# EAGLE schematic 6xshift_reg (EAGLE 5.11)
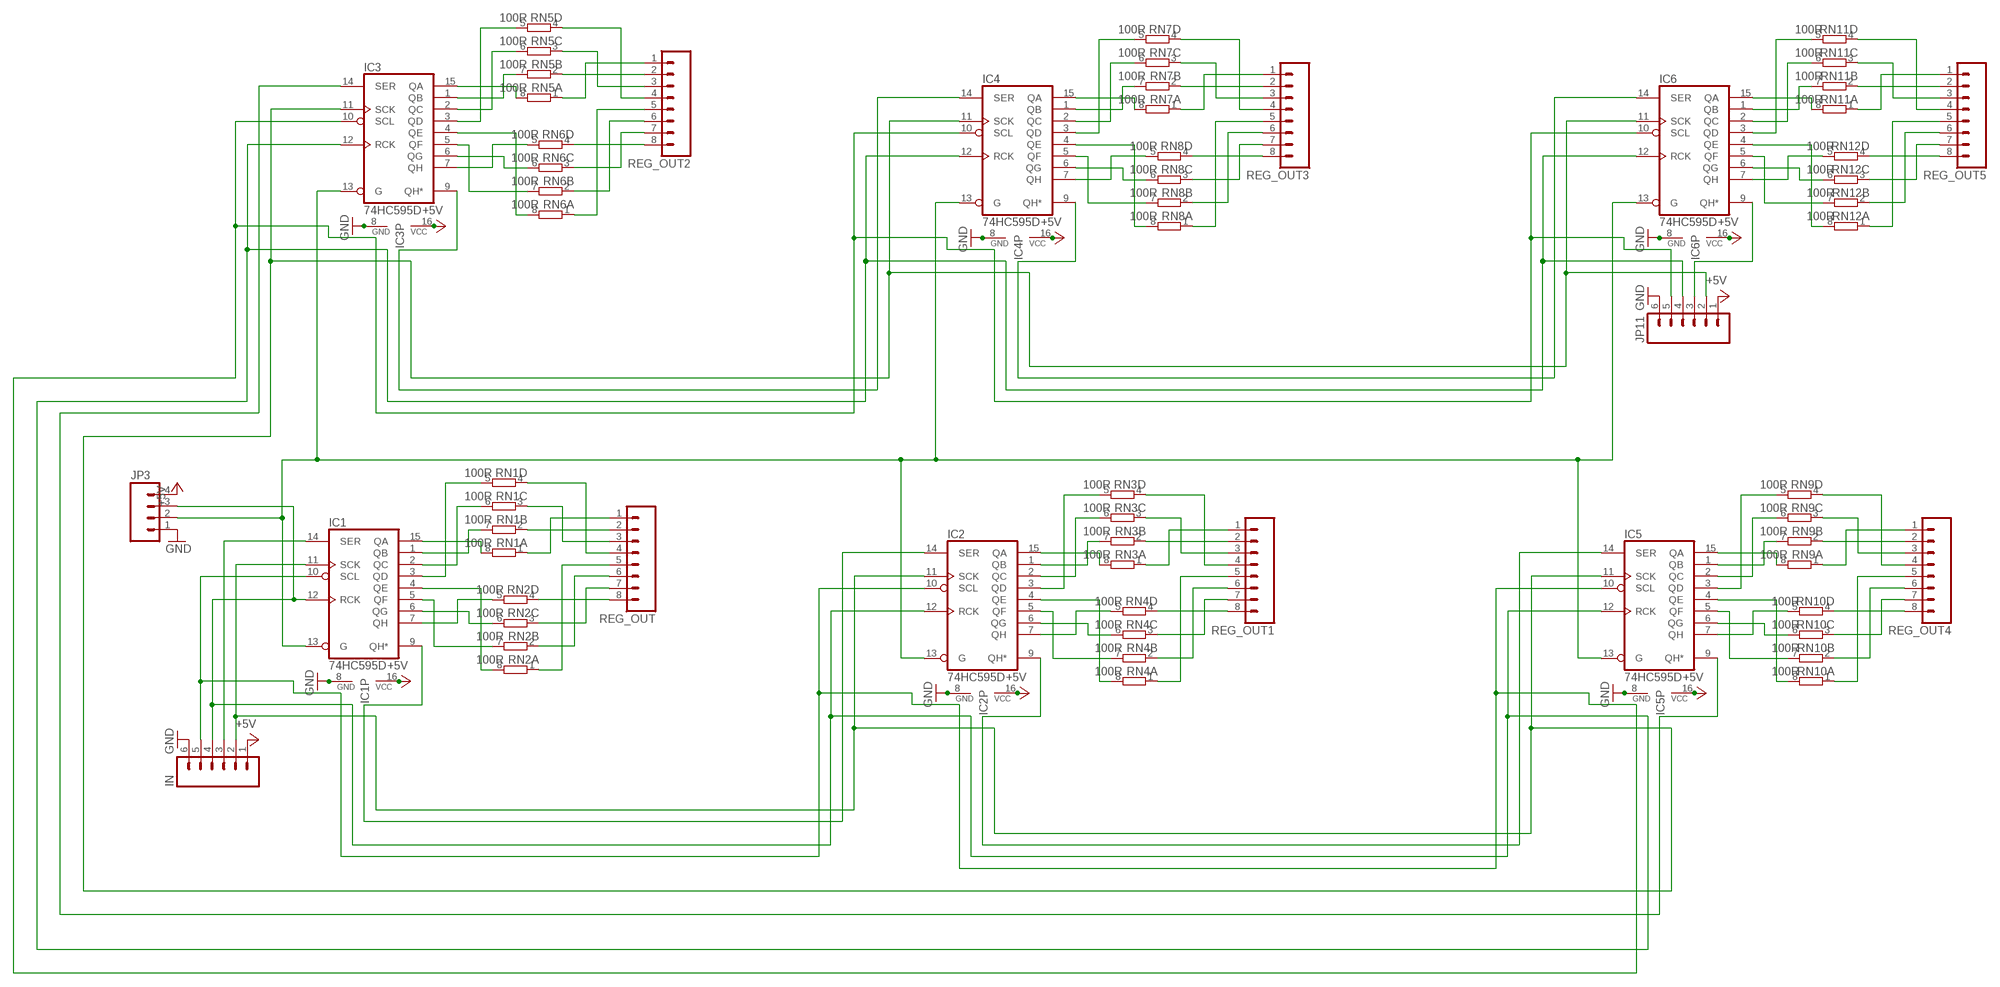
[diagram p0: schematic, sheet 1]

## Parts
IC1  74HC595D  [SO16]
IC2  74HC595D  [SO16]
IC3  74HC595D  [SO16]
IC4  74HC595D  [SO16]
IC5  74HC595D  [SO16]
IC6  74HC595D  [SO16]
IN  M06SIP  [1X06]
JP3  M04PTH  [1X04]
JP11  M06SIP  [1X06]
REG_OUT  M08  [1X08]
REG_OUT1  M08  [1X08]
REG_OUT2  M08  [1X08]
REG_OUT3  M08  [1X08]
REG_OUT4  M08  [1X08]
REG_OUT5  M08  [1X08]
RN1  100R  4R-NCAY16  [CAY16]
RN2  100R  4R-NCAY16  [CAY16]
RN3  100R  4R-NCAY16  [CAY16]
RN4  100R  4R-NCAY16  [CAY16]
RN5  100R  4R-NCAY16  [CAY16]
RN6  100R  4R-NCAY16  [CAY16]
RN7  100R  4R-NCAY16  [CAY16]
RN8  100R  4R-NCAY16  [CAY16]
RN9  100R  4R-NCAY16  [CAY16]
RN10  100R  4R-NCAY16  [CAY16]
RN11  100R  4R-NCAY16  [CAY16]
RN12  100R  4R-NCAY16  [CAY16]

## Nets
+5V [power]: IC1.16(VCC) IC2.16(VCC) IC3.16(VCC) IC4.16(VCC) IC5.16(VCC) IC6.16(VCC) IN.1 JP3.4 JP11.1
CLOCK: IC1.11(SCK) IC2.11(SCK) IC3.11(SCK) IC4.11(SCK) IC5.11(SCK) IC6.11(SCK) IN.2 JP11.2
DATA: IC1.14(SER) IN.3
DATA1: IC1.9(QH*) IC2.14(SER)
DATA2: IC3.14(SER) IC5.9(QH*)
DATA3: IC3.9(QH*) IC4.14(SER)
DATA4: IC2.9(QH*) IC5.14(SER)
DATA5: IC4.9(QH*) IC6.14(SER)
DATA_OUT5: IC6.9(QH*) JP11.3
GND [power]: IC1.8(GND) IC2.8(GND) IC3.8(GND) IC4.8(GND) IC5.8(GND) IC6.8(GND) IN.6 JP3.1 JP11.6
LATCH: IC1.12(RCK) IC2.12(RCK) IC3.12(RCK) IC4.12(RCK) IC5.12(RCK) IC6.12(RCK) IN.4 JP3.3 JP11.4
N$1: IC1.15(QA) RN1.8
N$2: IC1.1(QB) RN1.7
N$3: IC1.2(QC) RN1.6
N$4: IC1.3(QD) RN1.5
N$5: REG_OUT.1 RN1.1
N$6: REG_OUT.2 RN1.2
N$7: REG_OUT.3 RN1.3
N$8: REG_OUT.4 RN1.4
N$9: IC1.4(QE) RN2.8
N$10: IC1.5(QF) RN2.7
N$11: IC1.6(QG) RN2.6
N$12: IC1.7(QH) RN2.5
N$13: REG_OUT.5 RN2.1
N$14: REG_OUT.6 RN2.2
N$15: REG_OUT.7 RN2.3
N$16: REG_OUT.8 RN2.4
N$17: IC2.15(QA) RN3.8
N$18: IC2.1(QB) RN3.7
N$19: IC2.2(QC) RN3.6
N$20: IC2.3(QD) RN3.5
N$21: REG_OUT1.1 RN3.1
N$22: REG_OUT1.2 RN3.2
N$23: REG_OUT1.3 RN3.3
N$24: REG_OUT1.4 RN3.4
N$25: IC2.4(QE) RN4.8
N$26: IC2.5(QF) RN4.7
N$27: IC2.6(QG) RN4.6
N$28: IC2.7(QH) RN4.5
N$29: REG_OUT1.5 RN4.1
N$30: REG_OUT1.6 RN4.2
N$31: REG_OUT1.7 RN4.3
N$32: REG_OUT1.8 RN4.4
N$33: IC3.15(QA) RN5.8
N$34: IC3.1(QB) RN5.7
N$35: IC3.2(QC) RN5.6
N$36: IC3.3(QD) RN5.5
N$37: REG_OUT2.1 RN5.1
N$38: REG_OUT2.2 RN5.2
N$39: REG_OUT2.3 RN5.3
N$40: REG_OUT2.4 RN5.4
N$41: IC3.4(QE) RN6.8
N$42: IC3.5(QF) RN6.7
N$43: IC3.6(QG) RN6.6
N$44: IC3.7(QH) RN6.5
N$45: REG_OUT2.5 RN6.1
N$46: REG_OUT2.6 RN6.2
N$47: REG_OUT2.7 RN6.3
N$48: REG_OUT2.8 RN6.4
N$49: IC4.15(QA) RN7.8
N$50: IC4.1(QB) RN7.7
N$51: IC4.2(QC) RN7.6
N$52: IC4.3(QD) RN7.5
N$53: REG_OUT3.1 RN7.1
N$54: REG_OUT3.2 RN7.2
N$55: REG_OUT3.3 RN7.3
N$56: REG_OUT3.4 RN7.4
N$57: IC4.4(QE) RN8.8
N$58: IC4.5(QF) RN8.7
N$59: IC4.6(QG) RN8.6
N$60: IC4.7(QH) RN8.5
N$61: REG_OUT3.5 RN8.1
N$62: REG_OUT3.6 RN8.2
N$63: REG_OUT3.7 RN8.3
N$64: REG_OUT3.8 RN8.4
N$65: IC5.15(QA) RN9.8
N$66: IC5.1(QB) RN9.7
N$67: IC5.2(QC) RN9.6
N$68: IC5.3(QD) RN9.5
N$69: REG_OUT4.1 RN9.1
N$70: REG_OUT4.2 RN9.2
N$71: REG_OUT4.3 RN9.3
N$72: REG_OUT4.4 RN9.4
N$73: IC5.4(QE) RN10.8
N$74: IC5.5(QF) RN10.7
N$75: IC5.6(QG) RN10.6
N$76: IC5.7(QH) RN10.5
N$77: REG_OUT4.5 RN10.1
N$78: REG_OUT4.6 RN10.2
N$79: REG_OUT4.7 RN10.3
N$80: REG_OUT4.8 RN10.4
N$81: IC6.15(QA) RN11.8
N$82: IC6.1(QB) RN11.7
N$83: IC6.2(QC) RN11.6
N$84: IC6.3(QD) RN11.5
N$85: REG_OUT5.1 RN11.1
N$86: REG_OUT5.2 RN11.2
N$87: REG_OUT5.3 RN11.3
N$88: REG_OUT5.4 RN11.4
N$89: IC6.4(QE) RN12.8
N$90: IC6.5(QF) RN12.7
N$91: IC6.6(QG) RN12.6
N$92: IC6.7(QH) RN12.5
N$93: REG_OUT5.5 RN12.1
N$94: REG_OUT5.6 RN12.2
N$95: REG_OUT5.7 RN12.3
N$96: REG_OUT5.8 RN12.4
OE-: IC1.13(G) IC2.13(G) IC3.13(G) IC4.13(G) IC5.13(G) IC6.13(G) JP3.2
RESET-: IC1.10(SCL) IC2.10(SCL) IC3.10(SCL) IC4.10(SCL) IC5.10(SCL) IC6.10(SCL) IN.5 JP11.5

## Library data of the parts
IC1-IC6 = 74xx-eu:74*595: 8-bit SHIFT REGISTER, output latch
IN JP11 = SparkFun:M06: Header 6 Standard 6-pin 0.1" header. Use with straight break away headers (SKU : PRT-00116), right angle break away headers (PRT-00553), swiss pins (PRT-00743), machine pins (PRT-00117), and female headers (PRT-00115). Molex polarized connector foot print use with SKU : PRT-08094 with associated crimp pins and housings. NOTES ON THE VARIANTS LOCK and LOCK_LONGPADS... This footprint was designed to help hold the alignment of a through-hole component (i.e. 6-pin header) while soldering it into place. You may notice that each hole has been shifted either up or down by 0.005 of an inch from it's more standard position (which is a perfectly straight line). This slight alteration caused the pins (the squares in the middle) to touch the edges of the holes. Because they are alternating, it causes a "brace" to hold the component in place. 0.005 has proven to be the perfect amount of "off-center" position when using our standard breakaway headers. Although looks a little odd when you look at the bare footprint, once you have a header in there, the alteration is very hard to notice. Also, if you push a header all the way into place, it is covered up entirely on the bottom side. This idea of altering the position of holes to aid alignment will be further integrated into the Sparkfun Library for other footprints. It can help hold any component with 3 or more connection pins.
JP3 = SparkFun:M04: Header 4 Standard 4-pin 0.1" header. Use with straight break away headers (SKU : PRT-00116), right angle break away headers (PRT-00553), swiss pins (PRT-00743), machine pins (PRT-00117), and female headers (PRT-00115). Molex polarized connector foot print use with SKU : PRT-08231 with associated crimp pins and housings.
REG_OUT REG_OUT1-REG_OUT5 = SparkFun:M08: Header 8 Standard 8-pin 0.1" header. Use with straight break away headers (SKU : PRT-00116), right angle break away headers (PRT-00553), swiss pins (PRT-00743), machine pins (PRT-00117), and female headers (PRT-00115).
RN1-RN12 = resistor-dil:4R-N: Array Chip Resistor Source: RS Component / Phycomp; OC_FARNELL: unknown; OC_NEWARK: unknown

## Net classes
1 power: width 0.152 mm